# Altium schematic sheet UL-SWAP-DaQ-Schematic.SchDoc
size A; SheetNumber: 1; SheetTotal: 15
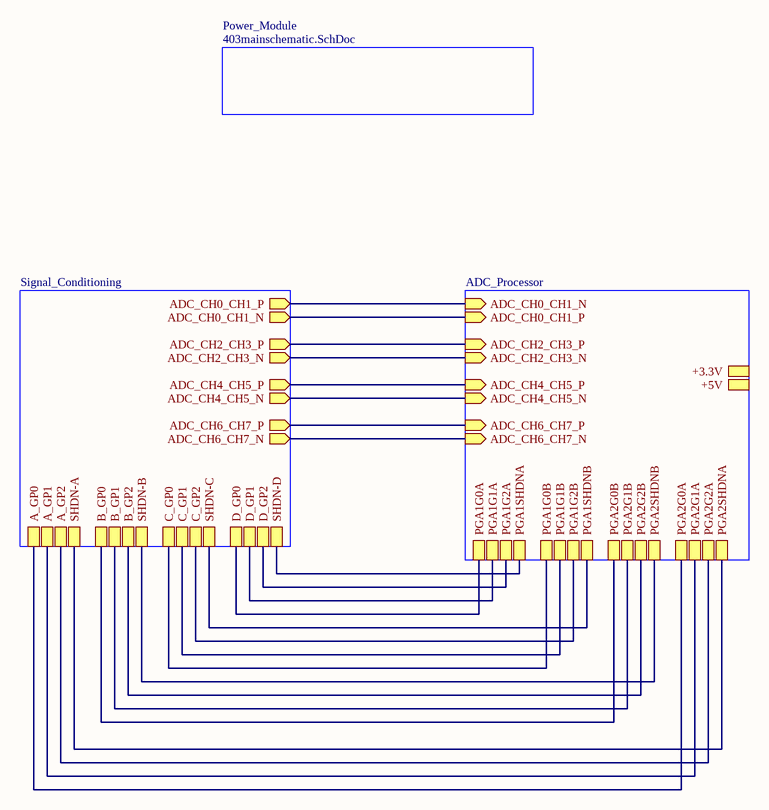
[diagram p0: UL-SWAP-DaQ-Schematic.SchDoc]

## Sub-sheets
ADC_Processor = ADC_PIC32_LVDS_DRIVER_Subsystem.SchDoc: PGA1G0A, PGA1G1A, PGA1G2A, PGA1SHDNA, PGA1G0B, PGA1G2B, PGA1SHDNB, PGA1G1B, PGA2G0B, PGA2G1B, PGA2G2B, PGA2SHDNB, PGA2G0A, PGA2G1A, PGA2G2A, PGA2SHDNA, +3.3V, +5V, ADC_CH6_CH7_N (in), ADC_CH6_CH7_P (in), ADC_CH4_CH5_N (in), ADC_CH4_CH5_P (in), ADC_CH2_CH3_N (in), ADC_CH2_CH3_P (in), ADC_CH0_CH1_P (in), ADC_CH0_CH1_N (in)
Power_Module = 403mainschematic.SchDoc: no entries
Signal_Conditioning = Capstone_Signal_Conditioners_Subsystem_Test_Schematic.SchDoc: A_GP0, A_GP1, A_GP2, SHDN-A, B_GP0, B_GP1, B_GP2, SHDN-B, C_GP0, C_GP1, C_GP2, SHDN-C, D_GP2, D_GP1, D_GP0, SHDN-D, ADC_CH0_CH1_P (out), ADC_CH0_CH1_N (out), ADC_CH2_CH3_P (out), ADC_CH2_CH3_N (out), ADC_CH4_CH5_N (out), ADC_CH4_CH5_P (out), ADC_CH6_CH7_P (out), ADC_CH6_CH7_N (out)

## Nets
(unnamed): sheet Signal_Conditioning/A_GP0, sheet ADC_Processor/PGA2G0A
(unnamed): sheet Signal_Conditioning/A_GP1, sheet ADC_Processor/PGA2G1A
(unnamed): sheet Signal_Conditioning/A_GP2, sheet ADC_Processor/PGA2G2A
(unnamed): sheet Signal_Conditioning/SHDN-A, sheet ADC_Processor/PGA2SHDNA
(unnamed): sheet Signal_Conditioning/B_GP0, sheet ADC_Processor/PGA2G0B
(unnamed): sheet Signal_Conditioning/B_GP1, sheet ADC_Processor/PGA2G1B
(unnamed): sheet Signal_Conditioning/B_GP2, sheet ADC_Processor/PGA2G2B
(unnamed): sheet Signal_Conditioning/SHDN-B, sheet ADC_Processor/PGA2SHDNB
(unnamed): sheet Signal_Conditioning/C_GP0, sheet ADC_Processor/PGA1G0B
(unnamed): sheet Signal_Conditioning/C_GP1, sheet ADC_Processor/PGA1G1B
(unnamed): sheet Signal_Conditioning/C_GP2, sheet ADC_Processor/PGA1G2B
(unnamed): sheet Signal_Conditioning/SHDN-C, sheet ADC_Processor/PGA1SHDNB
(unnamed): sheet Signal_Conditioning/D_GP2, sheet ADC_Processor/PGA1G2A
(unnamed): sheet Signal_Conditioning/D_GP1, sheet ADC_Processor/PGA1G1A
(unnamed): sheet Signal_Conditioning/D_GP0, sheet ADC_Processor/PGA1G0A
(unnamed): sheet Signal_Conditioning/SHDN-D, sheet ADC_Processor/PGA1SHDNA
(unnamed): sheet Signal_Conditioning/ADC_CH0_CH1_P, sheet ADC_Processor/ADC_CH0_CH1_N
(unnamed): sheet Signal_Conditioning/ADC_CH0_CH1_N, sheet ADC_Processor/ADC_CH0_CH1_P
(unnamed): sheet Signal_Conditioning/ADC_CH2_CH3_P, sheet ADC_Processor/ADC_CH2_CH3_P
(unnamed): sheet Signal_Conditioning/ADC_CH2_CH3_N, sheet ADC_Processor/ADC_CH2_CH3_N
(unnamed): sheet Signal_Conditioning/ADC_CH4_CH5_N, sheet ADC_Processor/ADC_CH4_CH5_N
(unnamed): sheet Signal_Conditioning/ADC_CH4_CH5_P, sheet ADC_Processor/ADC_CH4_CH5_P
(unnamed): sheet Signal_Conditioning/ADC_CH6_CH7_P, sheet ADC_Processor/ADC_CH6_CH7_P
(unnamed): sheet Signal_Conditioning/ADC_CH6_CH7_N, sheet ADC_Processor/ADC_CH6_CH7_N